# Altium project FlexEMG_v0r0.PrjPcb (part 2 of 2)

## Sheet FlexEMG_v0r0_BATT-CHARGER.SchDoc
size A
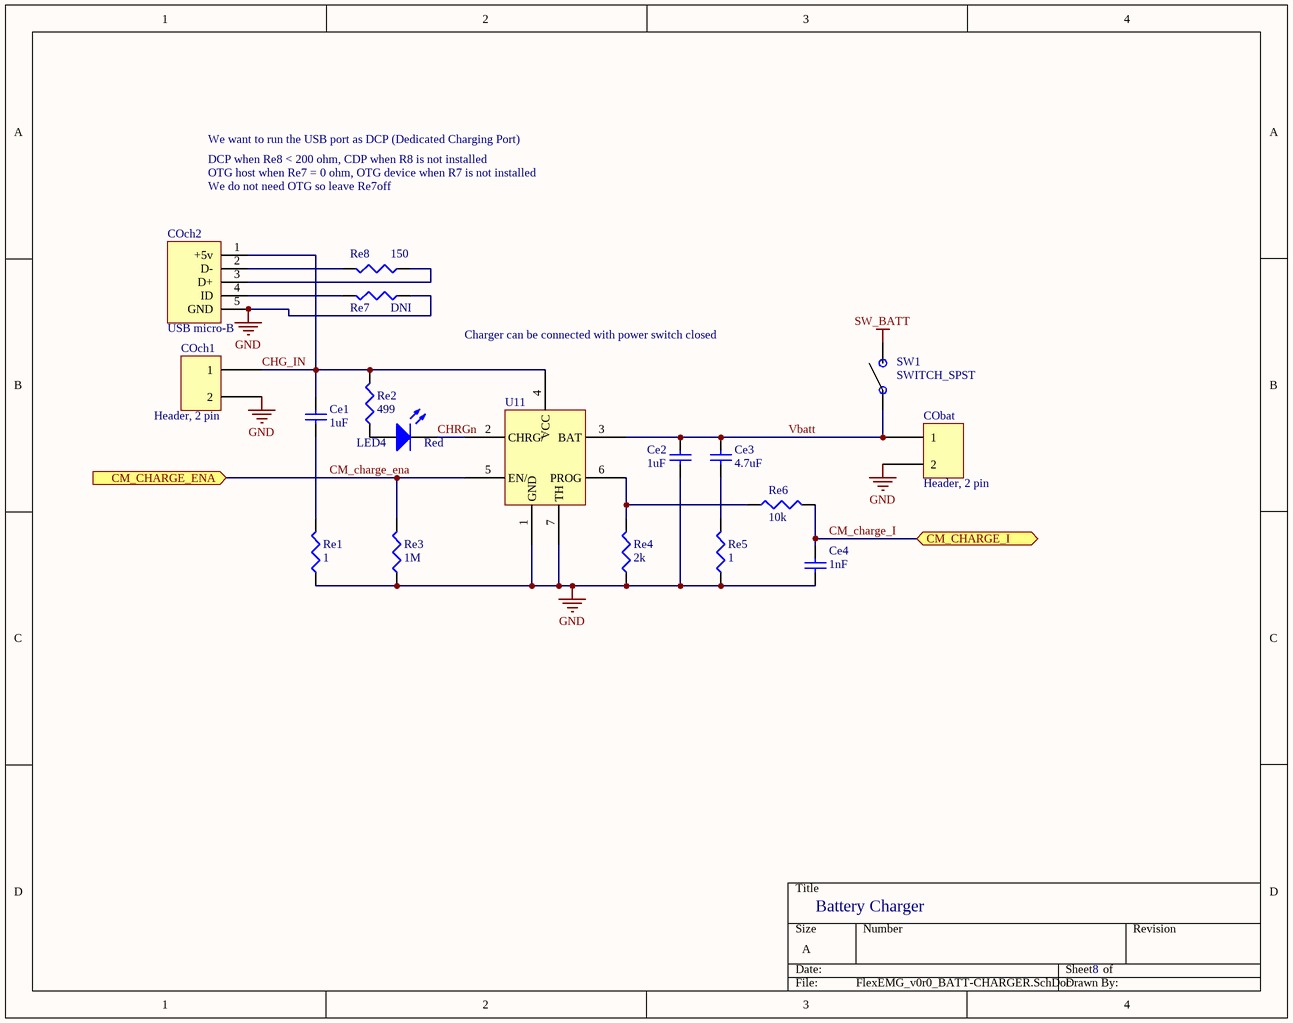
[diagram p7: FlexEMG_v0r0_BATT-CHARGER.SchDoc]

### Parts
Ce1  value 1uF  [c0402-TDK-C]  (hidden comment: C1005X5R1C105M050BC)
Ce2  value 1uF  [c0402-TDK-C]  (hidden comment: C1005X5R1C105M050BC)
Ce3  value 4.7uF  [c0603-Murata-GR]  (hidden comment: GRM188R6YA475KE15D)
Ce4  value 1nF  [c0402-Murata-GR]  (hidden comment: GRM155R61H102KA01D)
CObat  Header, 2 pin  [Header, 2 pin, 2mm(79mil)]
COch1  Header, 2 pin  [Header, 2 pin, 2mm(79mil)]
COch2  USB micro-B  [USB-microB_amp_10118194-0001LF]
LED4  Color: Red  [LED-0603]
Re1  value 1  [0402_p]  (hidden comment: ERJ-2BQF1R0X)
Re2  value 499  [0402_p]  (hidden comment: ERJ-2RKF4990X)
Re3  value 1M  [0402_p]  (hidden comment: ERJ-2RKF1004X)
Re4  value 2k  [0402_p]  (hidden comment: ERJ-2RKF2001X)
Re5  value 1  [0402_p]  (hidden comment: ERJ-2BQF1R0X)
Re6  value 10k  [0402_p]  (hidden comment: ERJ-2RKF1002X)
Re7  DNI  [0402_p]
Re8  value 150  [0402_p]  (hidden comment: ERJ-PA2J151X)
SW1  SWITCH_SPST  [SWITCH_SPST_CHS-01TB]
U11  LTC4065EDC#TRMPBF  [DFN-6_LT]  (value not drawn)

### Ports
CM_CHARGE_ENA (in), CM_CHARGE_I (bidir)

### Nets
GND: Ce2.1 Ce4.1 CObat.2 COch1.2 COch2.5(GND) Re1.1 Re3.1 Re4.1 Re5.1 Re7.1 U11.1(GND) U11.7(TH)
SW_BATT: SW1.1
CHG_IN: Ce1.2 COch1.1 COch2.1(+5v) Re2.2 U11.4(VCC)
CHRGn: LED4.2(K) U11.2(CHRG/)
CM_charge_ena: Re3.2 U11.5(EN/) ; port CM_CHARGE_ENA
CM_charge_I: Ce4.2 Re6.2 ; port CM_CHARGE_I
Vbatt: Ce2.2 Ce3.2 CObat.1 SW1.2 U11.3(BAT)
NetCe1_1: Ce1.1 Re1.2
NetCe3_1: Ce3.1 Re5.2
NetCOch2_2: COch2.2(D-) Re8.2
NetCOch2_3: COch2.3(D+) Re8.1
NetCOch2_4: COch2.4(ID) Re7.2
NetLED4_1: LED4.1(A) Re2.1
NetRe4_2: Re4.2 Re6.1 U11.6(PROG)

Not connected (* = marked no-connect by the designer): COch2 6 7 8 9

### Notes on the sheet
- DCP when Re8 < 200 ohm, CDP when R8 is not installed
- We want to run the USB port as DCP (Dedicated Charging Port)
- OTG host when Re7 = 0 ohm, OTG device when R7 is not installed
- We do not need OTG so leave Re7off
- Charger can be connected with power switch closed
- Battery Charger
- 8

### Library data of the parts
Ce1 Ce2 = Cap: CAP CER 1UF 16V X5R 0402; Manufacturer: TDK; Supplier: Digikey; Supplier PN: 445-9073-1-ND; Manufacturer PN: C1005X5R1C105M050BC
Ce3 = Cap: CAP CER 4.7UF 35V X5R 0603; Manufacturer: Murata; Supplier: Digikey; Supplier PN: 490-7205-1-ND; Manufacturer PN: GRM188R6YA475KE15D
Ce4 = Cap: CAP CER 1000PF 50V X5R 0402; Manufacturer: Murata; Supplier: Digikey; Supplier PN: 490-6316-1-ND; Manufacturer PN: GRM155R61H102KA01D
CObat COch1 = Header, 2 pin: Header 1x2; Manufacturer: Samtec; Manufacturer PN: TMM-102-03-T-S; Supplier: Digikey; Supplier PN: SAM8977-ND
COch2 = USB-microB: USB micro-B connector; Manufacturer: Amphenol; Manufacturer PN: 10118194-0001LF; Supplier: Digikey; Supplier PN: 609-4618-1-ND
LED4 = LED: LED RED CLEAR 0603 SMD; Manufacturer: Rohm; Manufacturer PN: SML-311UTT86; Supplier: Digikey; Supplier PN: 511-1304-1-ND
Re1 Re5 = Resistor: RES SMD 1 OHM 1% 1/6W 0402; Manufacturer: Panasonic; Manufacturer PN: ERJ-2BQF1R0X; Supplier: Digikey; Supplier P/N: P17252CT-ND; Power: 1/6W; Package: 0402
Re2 = Resistor: RES SMD 499 OHM 1% 1/10W 0402; Manufacturer: Panasonic; Manufacturer PN: ERJ-2RKF4990X; Supplier: Digikey; Supplier P/N: P499LCT-ND; Power: 1/10W; Package: 0402
Re3 = Resistor: RES SMD 1M OHM 1% 1/10W 0402; Manufacturer: Panasonic; Manufacturer PN: ERJ-2RKF1004X; Supplier: Digikey; Supplier P/N: P1.00MLCT-ND; Power: 1/10W; Package: 0402
Re4 = Resistor: RES SMD 2K OHM 1% 1/10W 0402; Manufacturer: Panasonic; Manufacturer PN: ERJ-2RKF2001X; Supplier: Digikey; Supplier P/N: P2.00KLCT-ND; Power: 1/10W; Package: 0402
Re6 = Resistor: RES SMD 10K OHM 1% 1/10W 0402; Manufacturer: Panasonic; Manufacturer PN: ERJ-2RKF1002X; Supplier: Digikey; Supplier P/N: P10.0KLCT-ND; Power: 1/10W; Package: 0402
Re7 = Resistor: Manufacturer: Panasonic; Power: 1/10W; Manufacturer PN: DNI; Supplier: Digikey; Package: 0402
Re8 = Resistor: RES SMD 150 OHM 5% 1/5W 0402; Manufacturer: Panasonic; Power: 1/10W; Manufacturer PN: ERJ-PA2J151X; Supplier: Digikey; Supplier P/N: P17188CT-ND; Package: 0402
SW1 = SWITCH_SPST: SWITCH SLIDE DIP SPST 100MA 6V; Manufacturer: Copal; Manufacturer PN: CHS-01TB; Supplier: Digikey; Supplier PN: 563-1004-1-ND
U11 = LTC4065EDC: IC CHARGER BATT LI-ON 6-DFN; Manufacturer: LT; Note: 4.4v float version is available (4.2 is standard): LTC4065EDC-4.4; Manufacturer PN: LTC4065EDC#TRMPBF; Supplier: Digikey; Supplier PN: LTC4065EDC#TRMPBFCT-ND

## Sheet FlexEMG_v0r0_POWER-SUPPLIES.SchDoc
size A
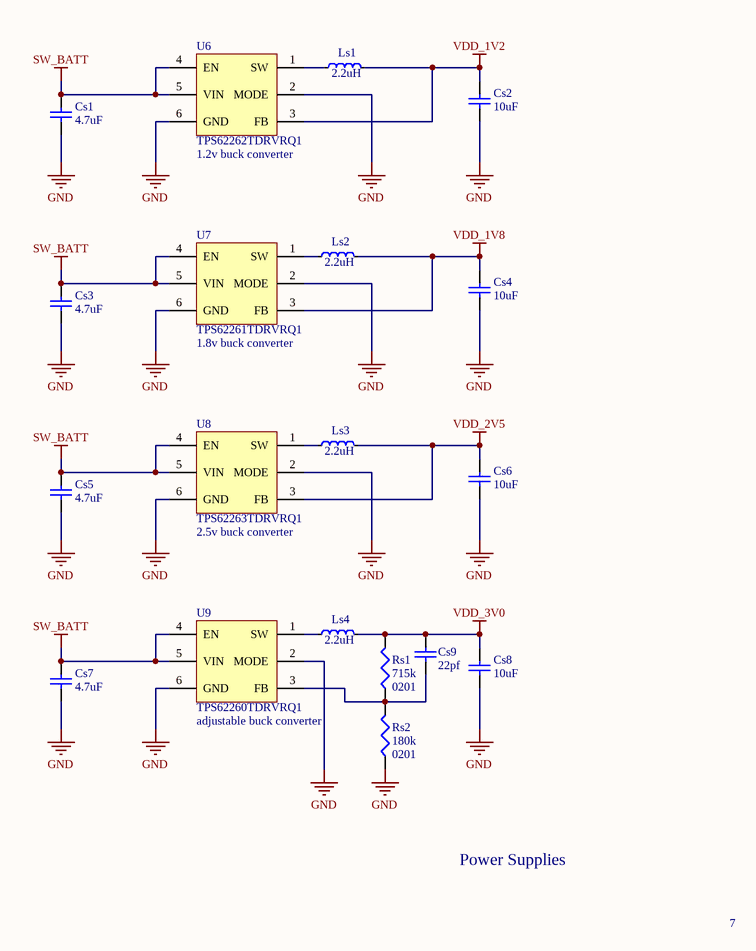
[diagram p8: FlexEMG_v0r0_POWER-SUPPLIES.SchDoc]

### Parts
Cs1  value 4.7uF  [c0603-Murata-GR]  (hidden comment: GRM188R6YA475KE15D)
Cs2  value 10uF  [c0603-Murata-GR]  (hidden comment: GRM188R61E106MA73D)
Cs3  value 4.7uF  [c0603-Murata-GR]  (hidden comment: GRM188R6YA475KE15D)
Cs4  value 10uF  [c0603-Murata-GR]  (hidden comment: GRM188R61E106MA73D)
Cs5  value 4.7uF  [c0603-Murata-GR]  (hidden comment: GRM188R6YA475KE15D)
Cs6  value 10uF  [c0603-Murata-GR]  (hidden comment: GRM188R61E106MA73D)
Cs7  value 4.7uF  [c0603-Murata-GR]  (hidden comment: GRM188R6YA475KE15D)
Cs8  value 10uF  [c0603-Murata-GR]  (hidden comment: GRM188R61E106MA73D)
Cs9  value 22pf  [c0402-Murata-GR]  (hidden comment: GRM1555C1H220FA01D)
Ls1  value 2.2uH  [LEAD_REGULATOR]
Ls2  value 2.2uH  [LEAD_REGULATOR]
Ls3  value 2.2uH  [LEAD_REGULATOR]
Ls4  value 2.2uH  [LEAD_REGULATOR]
Rs1  value 715k  Package: 0201  [0201_p]  (hidden comment: ERJ-1GEF7153C)
Rs2  value 180k  Package: 0201  [0201_p]  (hidden comment: ERJ-1GEF1803C)
U6  TPS62262TDRVRQ1  Note: 1.2v buck converter  [TPS_PACKAGE_novia]
U7  TPS62261TDRVRQ1  Note: 1.8v buck converter  [TPS_PACKAGE_novia]
U8  TPS62263TDRVRQ1  Note: 2.5v buck converter  [TPS_PACKAGE_novia]
U9  TPS62260TDRVRQ1  Note: adjustable buck converter  [TPS_PACKAGE_novia]

### Nets
GND: Cs1.1 Cs2.1 Cs3.1 Cs4.1 Cs5.1 Cs6.1 Cs7.1 Cs8.1 Rs2.1 U6.2(MODE) U6.6(GND) U6.7(GND) U7.2(MODE) U7.6(GND) U7.7(GND) U8.2(MODE) U8.6(GND) U8.7(GND) U9.2(MODE) U9.6(GND) U9.7(GND)
SW_BATT: Cs1.2 Cs3.2 Cs5.2 Cs7.2 U6.4(EN) U6.5(VIN) U7.4(EN) U7.5(VIN) U8.4(EN) U8.5(VIN) U9.4(EN) U9.5(VIN)
VDD_1V2: Cs2.2 Ls1.1 U6.3(FB)
VDD_1V8: Cs4.2 Ls2.1 U7.3(FB)
VDD_2V5: Cs6.2 Ls3.1 U8.3(FB)
VDD_3V0: Cs8.2 Cs9.2 Ls4.1 Rs1.2
NetCs9_1: Cs9.1 Rs1.1 Rs2.2 U9.3(FB)
NetLs1_2: Ls1.2 U6.1(SW)
NetLs2_2: Ls2.2 U7.1(SW)
NetLs3_2: Ls3.2 U8.1(SW)
NetLs4_2: Ls4.2 U9.1(SW)

### Notes on the sheet
- Power Supplies
- 7

### Library data of the parts
Cs1 Cs3 Cs5 Cs7 = Cap: as Ce3 on sheet FlexEMG_v0r0_BATT-CHARGER; Supplier: Digikey; Supplier PN: 490-7205-1-ND; Manufacturer PN: GRM188R6YA475KE15D
Cs2 Cs4 Cs6 Cs8 = Cap: CAP CER 10UF 25V X5R 0603 20%; Manufacturer: Murata; Supplier: Digikey; Supplier PN: 490-7202-1-ND; Manufacturer PN: GRM188R61E106MA73D
Cs9 = Cap: CAP CER 22PF 50V NP0 0402; Manufacturer: Murata; Supplier: Digikey; Supplier PN: 490-8589-1-ND; Manufacturer PN: GRM1555C1H220FA01D
Ls1-Ls4 = LEAD_REGUALTOR: FIXED IND 2.2UH 1A 120 MOHM SMD; Manufacturer PN: LQM2HPN2R2MJ0L; Manufacturer: Murata; Supplier PN: 490-6700-6-ND; Supplier: Digikey
Rs1 = Resistor: RES SMD 715K OHM 1% 1/20W 0201; Manufacturer: Panasonic; Manufacturer PN: ERJ-1GEF7153C; Supplier: Digikey; Supplier P/N: P715KABCT-ND; Power: 1/20W
Rs2 = Resistor: RES SMD 180K OHM 1% 1/20W 0201; Manufacturer: Panasonic; Manufacturer PN: ERJ-1GEF1803C; Supplier: Digikey; Supplier P/N: P180KABCT-ND; Power: 1/20W
U6 = TPS62262: IC REG BUCK 1.2V 0.6A SYNC 6SON; Manufacturer: TI; Supplier: Digikey; Supplier PN: 296-25730-1-ND; Manufacturer PN: TPS62262TDRVRQ1
U7 = TPS62261: IC REG BUCK 1.8V 0.6A SYNC 6SON; Manufacturer: TI; Supplier PN: 296-25729-1-ND; Supplier: Digikey; Manufacturer PN: TPS62261TDRVRQ1
U8 = TPS62263: IC REG BUCK 2.5V 0.6A SYNC 6SON; Manufacturer: TI; Supplier: Digikey; Supplier PN: 296-25731-1-ND; Manufacturer PN: TPS62263TDRVRQ1
U9 = TPS62260DRVR: IC REG BUCK ADJ 0.6A SYNC 6SON; Manufacturer: TI; Supplier PN: 296-36823-1-ND; Supplier: Digikey; Manufacturer PN: TPS62260TDRVRQ1

## Nets that join several sheets
GND: FlexEMG_v0r0_SF2-COMM (9 pins), FlexEMG_v0r0_SF2_DDR (24 pins), FlexEMG_v0r0_SF2-POWER (108 pins), FlexEMG_v0r0_RADIO (19 pins), FlexEMG_v0r0_NM (16 pins), FlexEMG_v0r0_ACCEL (8 pins), FlexEMG_v0r0_BATT-CHARGER (12 pins), FlexEMG_v0r0_POWER-SUPPLIES (21 pins)
SW_BATT: FlexEMG_v0r0_BATT-CHARGER (SW1.1), FlexEMG_v0r0_POWER-SUPPLIES (12 pins)
VDD_1V2: FlexEMG_v0r0_SF2-POWER (34 pins), FlexEMG_v0r0_NM (Cb20.2 Un3.5), FlexEMG_v0r0_POWER-SUPPLIES (Cs2.2 Ls1.1 U6.3)
VDD_1V8: FlexEMG_v0r0_SF2-COMM (CO1.4), FlexEMG_v0r0_SF2_DDR (16 pins), FlexEMG_v0r0_SF2-POWER (23 pins), FlexEMG_v0r0_RADIO (10 pins), FlexEMG_v0r0_NM (Cb40.2 Un5.A1 Un5.B2), FlexEMG_v0r0_ACCEL (Ca2.2 R6.2 R7.2 U10.8), FlexEMG_v0r0_POWER-SUPPLIES (Cs4.2 Ls2.1 U7.3)
VDD_2V5: FlexEMG_v0r0_SF2-COMM (Rc2.1 Rc3.2 Rc4.1), FlexEMG_v0r0_SF2-POWER (22 pins), FlexEMG_v0r0_POWER-SUPPLIES (Cs6.2 Ls3.1 U8.3)
VDD_3V0: FlexEMG_v0r0_SF2-POWER (10 pins), FlexEMG_v0r0_NM (Cb94.2 Rn2.2 U4.4 Un5.A2), FlexEMG_v0r0_ACCEL (Ca1.2 U10.13), FlexEMG_v0r0_POWER-SUPPLIES (Cs8.2 Cs9.2 Ls4.1 Rs1.2)
ACC_CLKIN: FlexEMG_v0r0_SF2-COMM (U1.T5), FlexEMG_v0r0_ACCEL (U10.1)
ACC_INT: FlexEMG_v0r0_SF2-COMM (U1.U5), FlexEMG_v0r0_ACCEL (U10.12)
ACC_SCL: FlexEMG_v0r0_SF2-COMM (U1.R5), FlexEMG_v0r0_ACCEL (R7.1 U10.23)
ACC_SDA: FlexEMG_v0r0_SF2-COMM (U1.R4), FlexEMG_v0r0_ACCEL (R6.1 U10.24)
C2N1_D: FlexEMG_v0r0_SF2-COMM (U1.K5), FlexEMG_v0r0_NM (RnC.2)
C2N1_V: FlexEMG_v0r0_SF2-COMM (U1.K4), FlexEMG_v0r0_NM (RnB.2)
CM_charge_I: FlexEMG_v0r0_RADIO (U3.F8), FlexEMG_v0r0_BATT-CHARGER (Ce4.2 Re6.2)
DRDY_NRF: FlexEMG_v0r0_SF2_DDR (U2.18), FlexEMG_v0r0_RADIO (U3.J7)
DRDY_OUT: FlexEMG_v0r0_SF2_DDR (U2.17), FlexEMG_v0r0_RADIO (U3.J6)
GPIO0: FlexEMG_v0r0_SF2-COMM (U1.Y1), FlexEMG_v0r0_SF2_DDR (J1.14 Rc0.2)
GPIO1: FlexEMG_v0r0_SF2-COMM (U1.AA2), FlexEMG_v0r0_SF2_DDR (J1.10 Rc1.2)
GPIO2: FlexEMG_v0r0_SF2-COMM (U1.T3), FlexEMG_v0r0_SF2_DDR (J1.11 RcC.2)
GPIO3: FlexEMG_v0r0_SF2-COMM (U1.U4), FlexEMG_v0r0_SF2_DDR (J1.9 RcD.2)
GPIO4: FlexEMG_v0r0_SF2-COMM (U1.V1), FlexEMG_v0r0_SF2_DDR (J1.12)
GPIO5: FlexEMG_v0r0_SF2-COMM (U1.W1), FlexEMG_v0r0_SF2_DDR (R2.1 R2.2)
JTAG.~{TRST}: FlexEMG_v0r0_SF2_DDR (J1.2 U2.48), FlexEMG_v0r0_RADIO (U3.H9)
JTAG.TCK: FlexEMG_v0r0_SF2_DDR (J1.3 U2.44), FlexEMG_v0r0_RADIO (U3.C9)
JTAG.TDI: FlexEMG_v0r0_SF2_DDR (J1.4 U2.47), FlexEMG_v0r0_RADIO (U3.F9)
JTAG.TDO: FlexEMG_v0r0_SF2_DDR (J1.6 U2.46), FlexEMG_v0r0_RADIO (U3.D9)
JTAG.TMS: FlexEMG_v0r0_SF2_DDR (J1.8 U2.45), FlexEMG_v0r0_RADIO (U3.E9)
N1_CLK: FlexEMG_v0r0_SF2-COMM (U1.Y2), FlexEMG_v0r0_NM (Un5.C1)
N12C_D: FlexEMG_v0r0_SF2-COMM (U1.K7), FlexEMG_v0r0_NM (Un3.3 Un3.6)
NetU1_G4: FlexEMG_v0r0_SF2-COMM (U1.G4), FlexEMG_v0r0_RADIO (U3.J5)
NetU1_G5: FlexEMG_v0r0_SF2-COMM (U1.G5), FlexEMG_v0r0_RADIO (U3.J4)
NetU1_L2: FlexEMG_v0r0_SF2-COMM (U1.L2), FlexEMG_v0r0_SF2_DDR (U2.20)
NetU1_L3: FlexEMG_v0r0_SF2-COMM (U1.L3), FlexEMG_v0r0_SF2_DDR (U2.19)
NetU1_T1: FlexEMG_v0r0_SF2-COMM (U1.T1), FlexEMG_v0r0_SF2_DDR (U2.59)
NetU1_T2: FlexEMG_v0r0_SF2-COMM (U1.T2), FlexEMG_v0r0_SF2_DDR (U2.58)
NetU2_36: FlexEMG_v0r0_SF2_DDR (U2.36), FlexEMG_v0r0_RADIO (U3.J8)
RXD: FlexEMG_v0r0_SF2-COMM (U1.D2), FlexEMG_v0r0_RADIO (U3.D8)
SPI_CLK_SF: FlexEMG_v0r0_SF2-COMM (U1.U2), FlexEMG_v0r0_SF2_DDR (U2.30), FlexEMG_v0r0_RADIO (Rr2.2)
SPI_nCS_SF: FlexEMG_v0r0_SF2-COMM (U1.P5), FlexEMG_v0r0_SF2_DDR (U2.38), FlexEMG_v0r0_RADIO (Rr3.2)
SPI_SDI_SF: FlexEMG_v0r0_SF2-COMM (U1.U1), FlexEMG_v0r0_SF2_DDR (U2.31), FlexEMG_v0r0_RADIO (Rr1.2)
SPI_SDO_SF: FlexEMG_v0r0_SF2-COMM (U1.P4), FlexEMG_v0r0_SF2_DDR (U2.33), FlexEMG_v0r0_RADIO (Rr0.2)
SWCLK: FlexEMG_v0r0_SF2-COMM (CO1.1), FlexEMG_v0r0_RADIO (U3.H2)
SWDIO: FlexEMG_v0r0_SF2-COMM (CO1.2), FlexEMG_v0r0_RADIO (U3.J2)
TXD: FlexEMG_v0r0_SF2-COMM (U1.E1), FlexEMG_v0r0_RADIO (U3.E8)